# Altium schematic sheet mcu.SchDoc
size A4
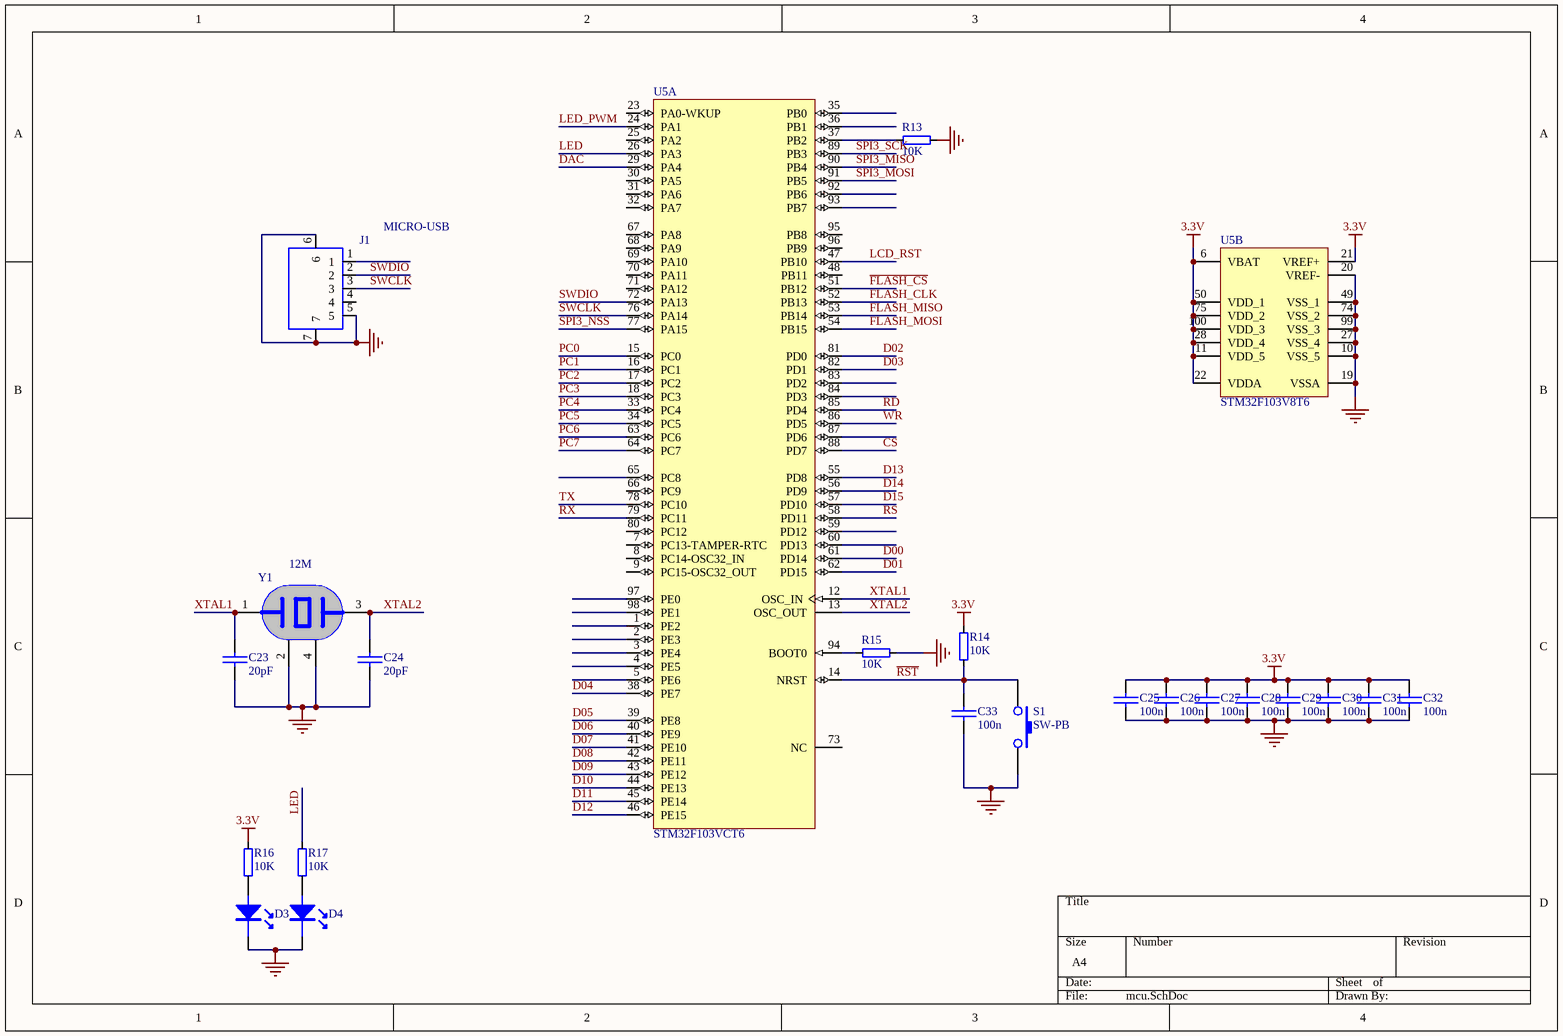
[diagram p0: mcu.SchDoc]

## Parts
C23  20pF  [0603]
C24  20pF  [0603]
C25  100n  [0603]
C26  100n  [0603]
C27  100n  [0603]
C28  100n  [0603]
C29  100n  [0603]
C30  100n  [0603]
C31  100n  [0603]
C32  100n  [0603]
C33  100n  [0603]
D3  LED  [0603-LED]  (value not drawn)
D4  LED  [0603-LED]  (value not drawn)
J1  MICRO-USB  [MICRO-USB]
R13  10K  [0603]
R14  10K  [0603]
R15  10K  [0603]
R16  10K  [0603]
R17  10K  [0603]
S1  SW-PB  [KEY6*4]
U5  STM32F103VCT6  [STM-LQFP100_N]  (parts A,B of 2)
Y1  12M  [XTAL-SMD3225]

## Nets
3.3V: C25.1 C26.1 C27.1 C28.1 C29.1 C30.1 C31.1 C32.1 R14.2 R16.2 U5.6(VBAT) U5.11(VDD_5) U5.21(VREF+) U5.22(VDDA) U5.28(VDD_4) U5.50(VDD_1) U5.75(VDD_2) U5.100(VDD_3)
GND: C23.2 C24.2 C25.2 C26.2 C27.2 C28.2 C29.2 C30.2 C31.2 C32.2 C33.2 D3.2(K) D4.2(K) J1.5 J1.6 J1.7 R13.2 R15.2 S1.2 U5.10(VSS_5) U5.19(VSSA) U5.20(VREF-) U5.27(VSS_4) U5.49(VSS_1) U5.74(VSS_2) U5.99(VSS_3) Y1.2 Y1.4
CS: U5.88(PD7)
D00: U5.61(PD14)
D01: U5.62(PD15)
D02: U5.81(PD0)
D03: U5.82(PD1)
D04: U5.38(PE7)
D05: U5.39(PE8)
D06: U5.40(PE9)
D07: U5.41(PE10)
D08: U5.42(PE11)
D09: U5.43(PE12)
D10: U5.44(PE13)
D11: U5.45(PE14)
D12: U5.46(PE15)
D13: U5.55(PD8)
D14: U5.56(PD9)
D15: U5.57(PD10)
DAC: U5.29(PA4)
~{FLASH_CS}: U5.51(PB12)
FLASH_CLK: U5.52(PB13)
FLASH_MISO: U5.53(PB14)
FLASH_MOSI: U5.54(PB15)
LCD_RST: U5.47(PB10)
LED: R17.2 U5.26(PA3)
LED_PWM: U5.24(PA1)
PC0: U5.15(PC0)
PC1: U5.16(PC1)
PC2: U5.17(PC2)
PC3: U5.18(PC3)
PC4: U5.33(PC4)
PC5: U5.34(PC5)
PC6: U5.63(PC6)
PC7: U5.64(PC7)
~{RST}: C33.1 R14.1 S1.1 U5.14(NRST)
RD: U5.85(PD4)
RS: U5.58(PD11)
RX: U5.79(PC11)
SPI3_MISO: U5.90(PB4)
SPI3_MOSI: U5.91(PB5)
SPI3_NSS: U5.77(PA15)
SPI3_SCK: U5.89(PB3)
SWCLK: J1.3 U5.76(PA14)
SWDIO: J1.2 U5.72(PA13)
TX: U5.78(PC10)
WR: U5.86(PD5)
XTAL1: C23.1 U5.12(OSC_IN) Y1.1
XTAL2: C24.1 U5.13(OSC_OUT) Y1.3
NetD3_1: D3.1(A) R16.1
NetD4_1: D4.1(A) R17.1
NetR13_1: R13.1 U5.37(PB2)
NetR15_1: R15.1 U5.94(BOOT0)

Not connected (* = marked no-connect by the designer): J1 1 4; U5 1(PE2) 2(PE3) 3(PE4) 4(PE5) 5(PE6) 7(PC13-TAMPER-RTC) 8(PC14-OSC32_IN) 9(PC15-OSC32_OUT) 23(PA0-WKUP) 25(PA2) 30(PA5) 31(PA6) 32(PA7) 35(PB0) 36(PB1) 48(PB11) 59(PD12) 60(PD13) 65(PC8) 66(PC9) 67(PA8) 68(PA9) 69(PA10) 70(PA11) 71(PA12) 73(NC) 80(PC12) 83(PD2) 84(PD3) 87(PD6) 92(PB6) 93(PB7) 95(PB8) 96(PB9) 97(PE0) 98(PE1)

## Library data of the parts
C23-C33 = CAP: 贴片瓷片电容
D3 D4 = LED: 贴片发光二极管
J1 = MICRO-USB: Micro USB插座
R13-R17 = RES: 贴片电阻（5%）
S1 = SW-PB: 按钮开关
U5 = STM32F103V8T6: ARM Cortex-M3 32-bit MCU, 64 KB Flash, 20 KB Internal RAM, 80 I/Os, 100-pin LQFP, -40 to 85 degC, Tray; A/D Converter: 2x12-bit (16 channel); FLASH Size (Prog) (kB): 64; I/Os (High Current): 80; Internal RAM Size (kB): 20; Operating Frequency(F) (Processor speed) (MHz): 72; Supply Voltage(Vcc) min (V): 2; DatasheetVersion: Rev. 16; PackageVersion: Rev. 1, 06/2013; PackageReference: LQFP100; PackageDescription: 100-Pin Low Profile Quad Flat Package, 14 x 14 mm Body, 0.5 mm Pitch; Supplier 1: Digi-Key; Supplier Part Number 1: 497-6068-ND; Supplier 2: Farnell; Supplier Part Number 2: 1447639; Supplier 3: Newark; Supplier Part Number 3: 59M2187; Supplier 4: Mouser; Supplier Part Number 4: 511-STM32F103V8T6; Core: ARM Cortex-M3; Packing: Tray; Mounting Technology: Surface Mount; PartNumber: STM32F103V8T6; ComponentLink1Description: Manufacturer URL; ComponentLink1URL: http://www.st.com/web/en/home.html; ComponentLink2Description: Datasheet; ComponentLink2URL: http://www.st.com/st-web-ui/static/active/en/resource/technical/document/datasheet/CD00161566.pdf; ComponentLink3Description: Package Specification; ComponentLink3URL: http://www.st.com/st-web-ui/static/active/en/resource/technical/document/data_brief/DM00071938.pdf
Y1 = XTAL4: 晶振